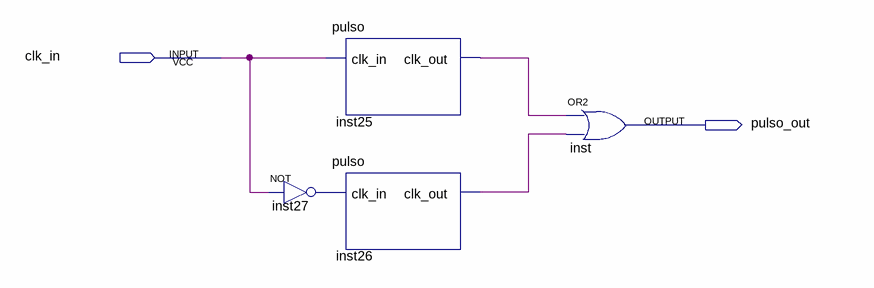
[diagram p0: schematic sheet]
// Quartus schematic multiplicador1.bdf as structural Verilog: 4 symbols, 2 pins
module multiplicador1 (
  input  clk_in,
  output pulso_out
);

  wire inst25_clk_out, inst26_clk_out, inst27_out;

  not inst27 (inst27_out, clk_in);
  pulso inst25 (.clk_in(clk_in), .clk_out(inst25_clk_out));
  pulso inst26 (.clk_in(inst27_out), .clk_out(inst26_clk_out));
  or inst (pulso_out, inst25_clk_out, inst26_clk_out);
endmodule
